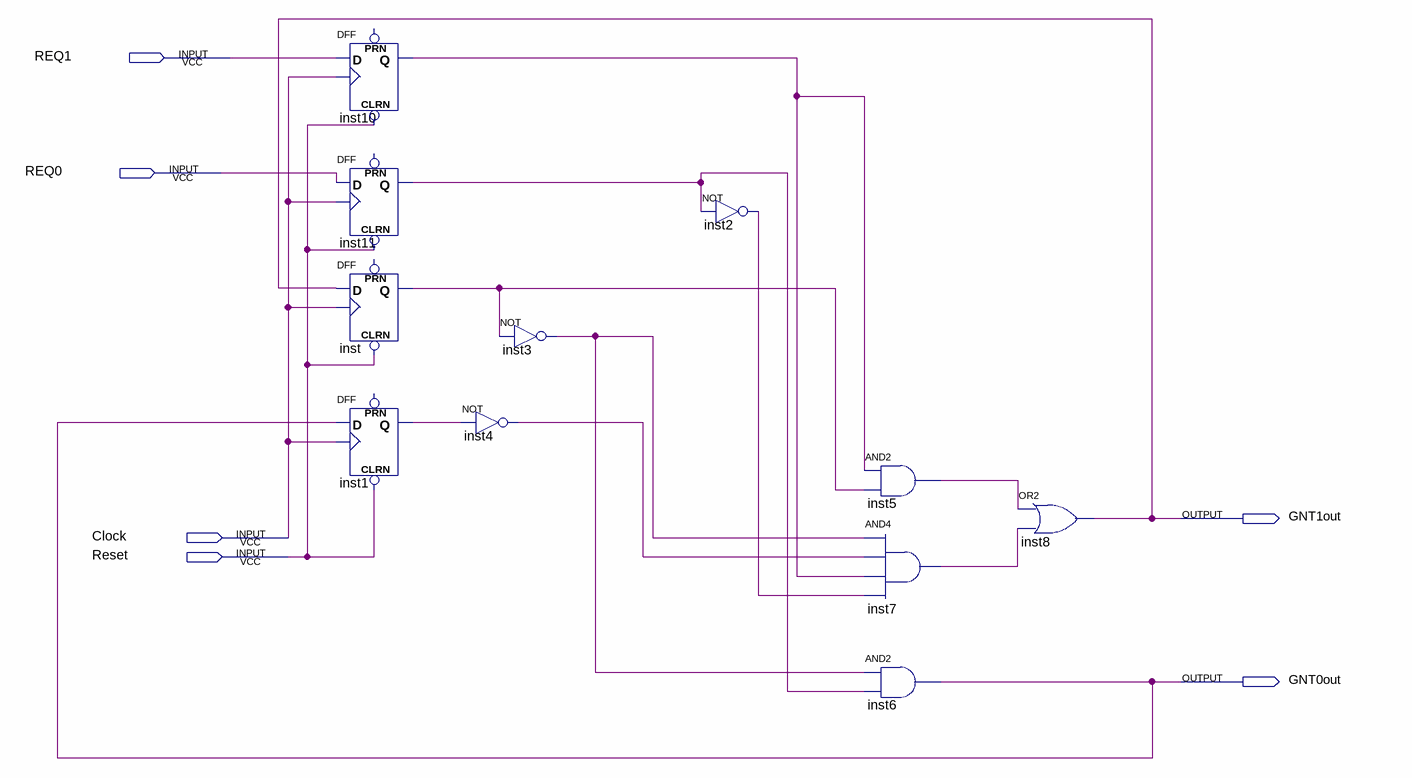
[diagram p0: schematic sheet]
// Quartus schematic arbiter.bdf as structural Verilog: 11 symbols, 6 pins
module arbiter (
  input  REQ1,
  input  REQ0,
  input  Clock,
  input  Reset,
  output GNT1out,
  output GNT0out
);

  wire inst1_q, inst2_out, inst3_out, inst4_out, inst5_out, inst7_out, inst10_q, inst11_q, inst_q;

  DFF inst10 (.CLRN(Reset), .CLK(Clock), .D(REQ1), .Q(inst10_q));  // open: PRN
  DFF inst11 (.CLRN(Reset), .CLK(Clock), .D(REQ0), .Q(inst11_q));  // open: PRN
  DFF inst (.CLRN(Reset), .CLK(Clock), .D(GNT1out), .Q(inst_q));  // open: PRN
  DFF inst1 (.CLRN(Reset), .CLK(Clock), .D(GNT0out), .Q(inst1_q));  // open: PRN
  not inst3 (inst3_out, inst_q);
  not inst4 (inst4_out, inst1_q);
  not inst2 (inst2_out, inst11_q);
  and inst5 (inst5_out, inst10_q, inst_q);
  and inst7 (inst7_out, inst3_out, inst4_out, inst10_q, inst2_out);
  and inst6 (GNT0out, inst3_out, inst11_q);
  or inst8 (GNT1out, inst5_out, inst7_out);
endmodule
